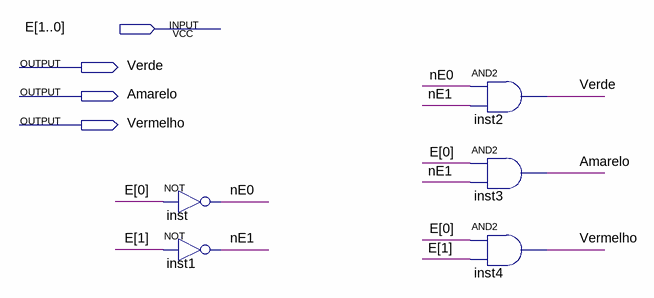
[diagram p0: schematic sheet]
// Quartus schematic LogicaDeSaida.bdf as structural Verilog: 5 symbols, 4 pins
module LogicaDeSaida (
  input  [1:0] E,
  output Verde,
  output Amarelo,
  output Vermelho
);

  wire nE0, nE1;

  not inst (nE0, E[0]);
  not inst1 (nE1, E[1]);
  and inst2 (Verde, nE0, nE1);
  and inst3 (Amarelo, E[0], nE1);
  and inst4 (Vermelho, E[0], E[1]);
endmodule
